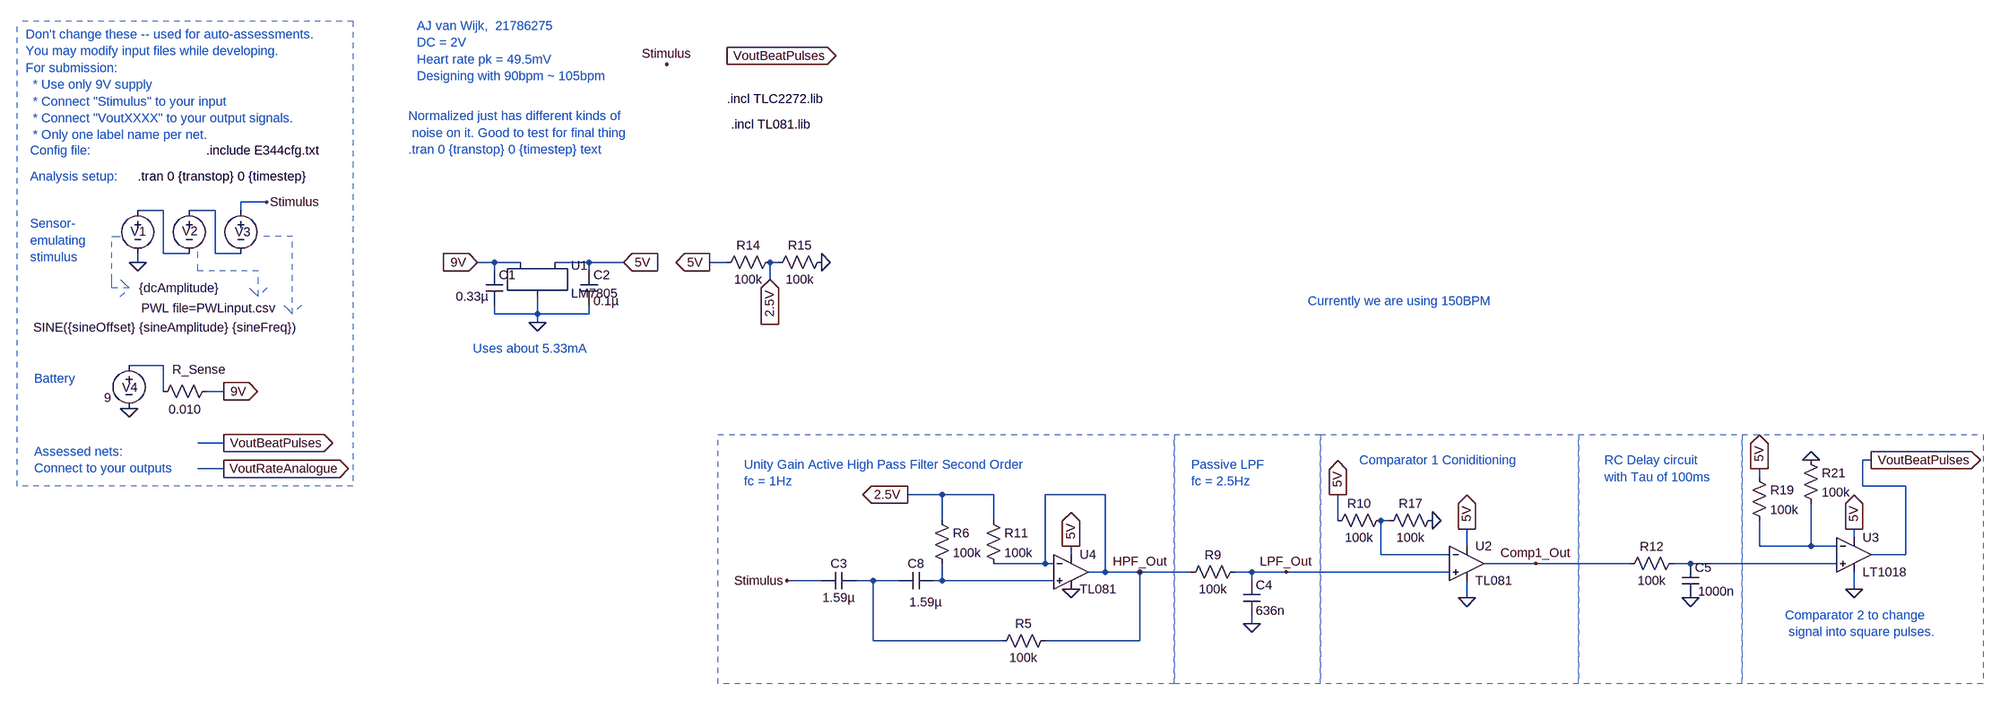
[diagram p0: schematic onlinetestdelete.asc]
onlinetestdelete.asc, the LTspice schematic file:
Version 4
SHEET 1 2240 680
WIRE -1840 -1072 -1888 -1072
WIRE -2032 -1056 -2080 -1056
WIRE -1936 -1056 -1984 -1056
WIRE -1888 -1056 -1888 -1072
WIRE -2032 -976 -2032 -1056
WIRE -1984 -976 -2032 -976
WIRE -1936 -976 -1936 -1056
WIRE -1888 -976 -1936 -976
WIRE -2080 -960 -2080 -976
WIRE -1408 -960 -1440 -960
WIRE -1360 -960 -1408 -960
WIRE -1232 -960 -1296 -960
WIRE -1168 -960 -1232 -960
WIRE -976 -960 -1008 -960
WIRE -880 -960 -896 -960
WIRE -1408 -944 -1408 -960
WIRE -1232 -944 -1232 -960
WIRE -896 -928 -896 -960
WIRE -1408 -864 -1408 -880
WIRE -1328 -864 -1328 -896
WIRE -1328 -864 -1408 -864
WIRE -1232 -864 -1232 -880
WIRE -1232 -864 -1328 -864
WIRE -1328 -848 -1328 -864
WIRE -2032 -768 -2096 -768
WIRE -2032 -720 -2032 -768
WIRE -1920 -720 -1952 -720
WIRE -1920 -624 -1968 -624
WIRE 1152 -592 1136 -592
WIRE -1920 -576 -1968 -576
WIRE 944 -560 944 -576
WIRE 1136 -544 1136 -592
WIRE 1216 -544 1136 -544
WIRE -576 -528 -640 -528
WIRE -480 -528 -576 -528
WIRE -272 -528 -384 -528
WIRE -576 -480 -576 -528
WIRE -480 -480 -480 -528
WIRE 160 -480 160 -528
WIRE 256 -480 240 -480
WIRE 1120 -448 1120 -464
WIRE 400 -432 400 -464
WIRE 944 -432 944 -480
WIRE 1040 -432 1040 -512
WIRE 1040 -432 944 -432
WIRE 1088 -432 1040 -432
WIRE -336 -416 -336 -432
WIRE 240 -416 240 -480
WIRE 368 -416 240 -416
WIRE 1216 -416 1216 -544
WIRE 1216 -416 1152 -416
WIRE -384 -400 -384 -528
WIRE -384 -400 -480 -400
WIRE -368 -400 -384 -400
WIRE 528 -400 432 -400
WIRE 704 -400 528 -400
WIRE 816 -400 784 -400
WIRE 1088 -400 816 -400
WIRE -272 -384 -272 -528
WIRE -272 -384 -304 -384
WIRE -208 -384 -272 -384
WIRE -112 -384 -208 -384
WIRE 0 -384 -32 -384
WIRE 64 -384 0 -384
WIRE 368 -384 64 -384
WIRE -800 -368 -864 -368
WIRE -704 -368 -736 -368
WIRE -656 -368 -704 -368
WIRE -576 -368 -576 -400
WIRE -576 -368 -592 -368
WIRE -368 -368 -576 -368
WIRE 0 -368 0 -384
WIRE 1120 -352 1120 -384
WIRE 400 -336 400 -368
WIRE 0 -288 0 -304
WIRE -704 -256 -704 -368
WIRE -464 -256 -704 -256
WIRE -208 -256 -208 -384
WIRE -208 -256 -384 -256
FLAG -2080 -960 0
FLAG -1840 -1072 Stimulus
FLAG -1920 -720 9V
IOPIN -1920 -720 Out
FLAG -2096 -688 0
FLAG -1920 -624 VoutBeatPulses
IOPIN -1920 -624 Out
FLAG -1920 -576 VoutRateAnalogue
IOPIN -1920 -576 Out
FLAG -1328 -848 0
FLAG -1088 -1328 Stimulus
FLAG -336 -432 5V
IOPIN -336 -432 Out
FLAG -336 -352 0
FLAG 0 -288 0
FLAG 400 -336 0
FLAG 816 -336 0
FLAG 1120 -352 0
FLAG 400 -464 5V
IOPIN 400 -464 Out
FLAG 1120 -464 5V
IOPIN 1120 -464 Out
FLAG -864 -368 Stimulus
FLAG -800 -960 0
FLAG -1008 -960 5V
IOPIN -1008 -960 Out
FLAG -896 -928 2.5V
IOPIN -896 -928 In
FLAG -640 -528 2.5V
IOPIN -640 -528 Out
FLAG 336 -480 0
FLAG 160 -528 5V
IOPIN 160 -528 Out
FLAG 944 -576 5V
IOPIN 944 -576 Out
FLAG 1040 -592 0
FLAG 64 -384 LPF_Out
FLAG 528 -400 Comp1_Out
FLAG -208 -384 HPF_Out
FLAG -1440 -960 9V
IOPIN -1440 -960 In
FLAG -976 -1344 VoutBeatPulses
IOPIN -976 -1344 Out
FLAG 1152 -592 VoutBeatPulses
IOPIN 1152 -592 Out
FLAG -1168 -960 5V
IOPIN -1168 -960 In
SYMBOL voltage -1984 -1072 R0
WINDOW 123 0 0 Left 0
WINDOW 39 0 0 Left 0
WINDOW 3 -89 197 Left 2
WINDOW 0 -13 54 Left 2
SYMATTR Value PWL file=PWLinput.csv
SYMATTR InstName V2
SYMBOL voltage -1888 -1072 R0
WINDOW 123 24 44 Left 2
WINDOW 39 0 0 Left 0
WINDOW 3 -386 233 Left 2
WINDOW 0 -11 56 Left 2
SYMATTR Value SINE({sineOffset} {sineAmplitude} {sineFreq})
SYMATTR InstName V3
SYMBOL voltage -2080 -1072 R0
WINDOW 123 0 0 Left 0
WINDOW 39 0 0 Left 0
WINDOW 3 3 160 Left 2
WINDOW 0 -13 55 Left 2
SYMATTR Value {dcAmplitude}
SYMATTR InstName V1
SYMBOL voltage -2096 -784 R0
WINDOW 123 24 44 Left 2
WINDOW 39 0 0 Left 0
WINDOW 3 -46 76 Left 2
WINDOW 0 -13 57 Left 2
SYMATTR Value 9
SYMATTR InstName V4
SYMBOL res -1936 -736 R90
WINDOW 0 -9 30 VBottom 2
WINDOW 3 34 56 VTop 2
SYMATTR InstName R_Sense
SYMATTR Value 0.010
SYMBOL LM7805 -1328 -944 R0
SYMATTR InstName U1
SYMBOL cap -1248 -944 R0
SYMATTR InstName C2
SYMATTR Value 0.1µ
SYMBOL cap -1424 -944 R0
WINDOW 3 -56 48 Left 2
SYMATTR Value 0.33µ
SYMATTR InstName C1
SYMBOL Opamps\\opamp2 -336 -448 R0
SYMATTR InstName U4
SYMATTR Value TL081
SYMBOL cap -592 -384 R90
WINDOW 0 0 32 VBottom 2
WINDOW 3 40 14 VTop 2
SYMATTR InstName C8
SYMATTR Value 1.59µ
SYMBOL res -368 -272 R90
WINDOW 0 0 56 VBottom 2
WINDOW 3 32 56 VTop 2
SYMATTR InstName R5
SYMATTR Value 100k
SYMBOL cap -736 -384 R90
WINDOW 0 0 32 VBottom 2
WINDOW 3 32 32 VTop 2
SYMATTR InstName C3
SYMATTR Value 1.59µ
SYMBOL res -592 -496 R0
SYMATTR InstName R6
SYMATTR Value 100k
SYMBOL res -496 -496 R0
SYMATTR InstName R11
SYMATTR Value 100k
SYMBOL res -16 -400 R90
WINDOW 0 0 56 VBottom 2
WINDOW 3 32 56 VTop 2
SYMATTR InstName R9
SYMATTR Value 100k
SYMBOL cap -16 -368 R0
SYMATTR InstName C4
SYMATTR Value 636n
SYMBOL cap 800 -400 R0
WINDOW 3 30 52 Left 2
SYMATTR Value 1000n
SYMATTR InstName C5
SYMBOL res 800 -416 R90
WINDOW 0 0 56 VBottom 2
WINDOW 3 32 56 VTop 2
SYMATTR InstName R12
SYMATTR Value 100k
SYMBOL res -992 -944 R270
WINDOW 0 32 56 VTop 2
WINDOW 3 0 56 VBottom 2
SYMATTR InstName R14
SYMATTR Value 100k
SYMBOL res -896 -944 R270
WINDOW 0 32 56 VTop 2
WINDOW 3 0 56 VBottom 2
SYMATTR InstName R15
SYMATTR Value 100k
SYMBOL res 144 -464 R270
WINDOW 0 32 56 VTop 2
WINDOW 3 0 56 VBottom 2
SYMATTR InstName R10
SYMATTR Value 100k
SYMBOL res 240 -464 R270
WINDOW 0 32 56 VTop 2
WINDOW 3 0 56 VBottom 2
SYMATTR InstName R17
SYMATTR Value 100k
SYMBOL res 928 -576 R0
SYMATTR InstName R19
SYMATTR Value 100k
SYMBOL res 1024 -608 R0
SYMATTR InstName R21
SYMATTR Value 100k
SYMBOL Comparators\\LT1018 1120 -416 R0
SYMATTR InstName U3
SYMBOL Opamps\\opamp2 400 -464 R0
SYMATTR InstName U2
SYMATTR Value TL081
TEXT -2080 -1120 Left 2 !.tran 0 {transtop} 0 {timestep}
TEXT -1952 -1168 Left 2 !.include E344cfg.txt
TEXT -2288 -1384 Left 2 ;Don't change these -- used for auto-assessments.\nYou may modify input files while developing.\nFor submission: \n  * Use only 9V supply \n  * Connect "Stimulus" to your input\n  * Connect "VoutXXXX" to your output signals.\n  * Only one label name per net.
TEXT -2280 -1168 Left 2 ;Config file:
TEXT -2280 -1120 Left 2 ;Analysis setup:
TEXT -2272 -744 Left 2 ;Battery
TEXT -2280 -1032 Left 2 ;Sensor-\nemulating \nstimulus
TEXT -2272 -608 Left 2 ;Assessed nets:\nConnect to your outputs
TEXT -1552 -1400 Left 2 ;AJ van Wijk,  21786275\nDC = 2V\nHeart rate pk = 49.5mV\nDesigning with 90bpm ~ 105bpm
TEXT -968 -1216 Left 2 !.incl TL081.lib
TEXT -1568 -1232 Left 2 ;Normalized just has different kinds of\n noise on it. Good to test for final thing\n.tran 0 {transtop} 0 {timestep} text
TEXT -944 -584 Left 2 ;Unity Gain Active High Pass Filter Second Order\nfc = 1Hz
TEXT 200 -592 Left 2 ;Comparator 1 Coniditioning
TEXT -112 -584 Left 2 ;Passive LPF\nfc = 2.5Hz
TEXT 656 -592 Left 2 ;RC Delay circuit\nwith Tau of 100ms
TEXT 992 -304 Left 2 ;Comparator 2 to change\n signal into square pulses.
TEXT -976 -1264 Left 2 !.incl TLC2272.lib
TEXT -1448 -800 Left 2 ;Uses about 5.33mA
TEXT 104 -888 Left 2 ;Currently we are using 150BPM
LINE Normal -1792 -1008 -1856 -1008 2
LINE Normal -1792 -864 -1792 -1008 2
LINE Normal -1808 -880 -1792 -864 2
LINE Normal -1792 -864 -1808 -880 2
LINE Normal -1776 -880 -1792 -864 2
LINE Normal -2128 -1008 -2112 -1008 2
LINE Normal -2128 -928 -2128 -1008 2
LINE Normal -2128 -912 -2128 -928 2
LINE Normal -2096 -912 -2128 -912 2
LINE Normal -2112 -928 -2096 -912 2
LINE Normal -2096 -912 -2112 -928 2
LINE Normal -2112 -896 -2096 -912 2
LINE Normal -1968 -944 -1968 -992 2
LINE Normal -1856 -944 -1968 -944 2
LINE Normal -1856 -896 -1856 -944 2
LINE Normal -1872 -912 -1856 -896 2
LINE Normal -1856 -896 -1872 -912 2
LINE Normal -1840 -912 -1856 -896 2
LINE Normal -2304 -544 -2304 -1408 1
LINE Normal -1680 -1408 -1680 -544 1
LINE Normal -1680 -544 -2304 -544 1
LINE Normal -1680 -1408 -2304 -1408 1
RECTANGLE Normal -144 -176 -992 -640 2
RECTANGLE Normal 128 -176 -144 -640 2
RECTANGLE Normal 608 -176 128 -640 2
RECTANGLE Normal 912 -176 608 -640 2
RECTANGLE Normal 1360 -176 912 -640 2

The netlist it stands for:
* onlinetestdelete.asc
V2 N002 N001 PWL file=PWLinput.csv
V3 Stimulus N002 SINE({sineOffset} {sineAmplitude} {sineFreq})
V1 N001 0 {dcAmplitude}
V4 N003 0 9
R_Sense 9V N003 0.010
XU1 9V 0 5V LM7805
C2 5V 0 0.1µ
C1 9V 0 0.33µ
XU4 N008 HPF_Out 5V 0 HPF_Out TL081  ; pins In+ In- V+ V- OUT
C8 N008 N007 1.59µ
R5 HPF_Out N007 100k
C3 N007 Stimulus 1.59µ
R6 2.5V N008 100k
R11 2.5V HPF_Out 100k
R9 LPF_Out HPF_Out 100k
C4 LPF_Out 0 636n
C5 N006 0 1000n
R12 N006 Comp1_Out 100k
R14 5V 2.5V 100k
R15 2.5V 0 100k
R10 5V N004 100k
R17 N004 0 100k
R19 5V N005 100k
R21 0 N005 100k
XU3 N006 N005 5V 0 VoutBeatPulses LT1018  ; pins In+ In- V+ V- OUT
XU2 LPF_Out N004 5V 0 Comp1_Out TL081  ; pins In+ In- V+ V- OUT
.tran 0 {transtop} 0 {timestep}
.include E344cfg.txt
* Don't change these -- used for auto-assessments.
* You may modify input files while developing.
* For submission:
*   * Use only 9V supply
*   * Connect "Stimulus" to your input
*   * Connect "VoutXXXX" to your output signals.
*   * Only one label name per net.
* Config file:
* Analysis setup:
* Battery
* Sensor-
* emulating
* stimulus
* Assessed nets:
* Connect to your outputs
* AJ van Wijk,  21786275
* DC = 2V
* Heart rate pk = 49.5mV
* Designing with 90bpm ~ 105bpm
.incl TL081.lib
* Normalized just has different kinds of
*  noise on it. Good to test for final thing
* .tran 0 {transtop} 0 {timestep} text
* Unity Gain Active High Pass Filter Second Order
* fc = 1Hz
* Comparator 1 Coniditioning
* Passive LPF
* fc = 2.5Hz
* RC Delay circuit
* with Tau of 100ms
* Comparator 2 to change
*  signal into square pulses.
.incl TLC2272.lib
* Uses about 5.33mA
* Currently we are using 150BPM
.lib LTC1.lib
.backanno
.end